# Altium project PCB_Project.PrjPcb
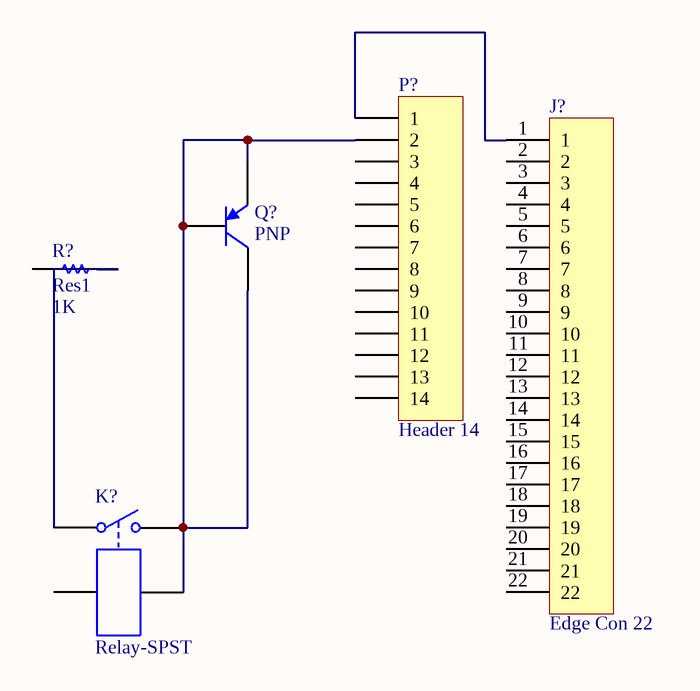
[diagram p0: Sheet2.SchDoc]
2 sheets, 5 parts. Net scope: global (net labels, ports and power ports of the same name join across sheets).
Board file: PCB1.PcbDoc
Sheets:
  Sheet1.SchDoc
  Sheet2.SchDoc

## Sheet Sheet1.SchDoc
size A4

## Sheet Sheet2.SchDoc
size A4

### Parts
J?  Edge Con 22  [PIN22]
K?  Relay-SPST  [MODULE4]
P?  Header 14  [HDR1X14]
Q?  PNP  [SOT-23B_N]
R?  Res1  value 1K  [AXIAL-0.3]

### Nets
NetJ?_1: J?.1 P?.1
NetK?_1: K?.1 R?.2
NetK?_2: K?.2 K?.4 P?.2 Q?.1(C) Q?.2(B) Q?.3(E)

Not connected (* = marked no-connect by the designer): J? 2 3 4 5 6 7 8 9 10 11 12 13 14 15 16 17 18 19 20 21 22; K? 3; P? 3 4 5 6 7 8 9 10 11 12 13 14; R? 1

### Library data of the parts
J? = Edge Con 22: 22-Pin Edge Connector; LatestRevisionDate: 17-Jul-2002; LatestRevisionNote: Re-released for DXP Platform.; Publisher: Altium Limited
K? = Relay-SPST: Single-Pole Single-Throw Relay; Published: 24-Mar-1999; LatestRevisionDate: 17-Jul-2002; LatestRevisionNote: Re-released for DXP Platform.; PackageReference: MODULE4; Publisher: Altium Limited
P? = Header 14: Header, 14-Pin; LatestRevisionDate: 17-Jul-2002; LatestRevisionNote: Re-released for DXP Platform.; Publisher: Altium Limited
Q? = PNP: PNP Bipolar Transistor; Published: 8-Jun-2000; LatestRevisionDate: 29-May-2009; LatestRevisionNote: IPC-7351 Footprint Added.; PackageVersion: Aug-1999; PackageReference: SOT-23B; Publisher: Altium Limited; PackageDescription: 3-Pin SOT-23 Package 0.95 mm Pitch, 2.4 mm Lead Span
R? = Res1: Resistor; Published: 8-Jun-2000; LatestRevisionDate: 17-Jul-2002; LatestRevisionNote: Re-released for DXP Platform.; PackageReference: AXIAL-0.3; Publisher: Altium Limited; PackageDescription: Axial Device, Thru-Hole; 2 Leads; 0.3 in Pin Spacing